# EAGLE design Control board V5 (EAGLE 8.2.1)
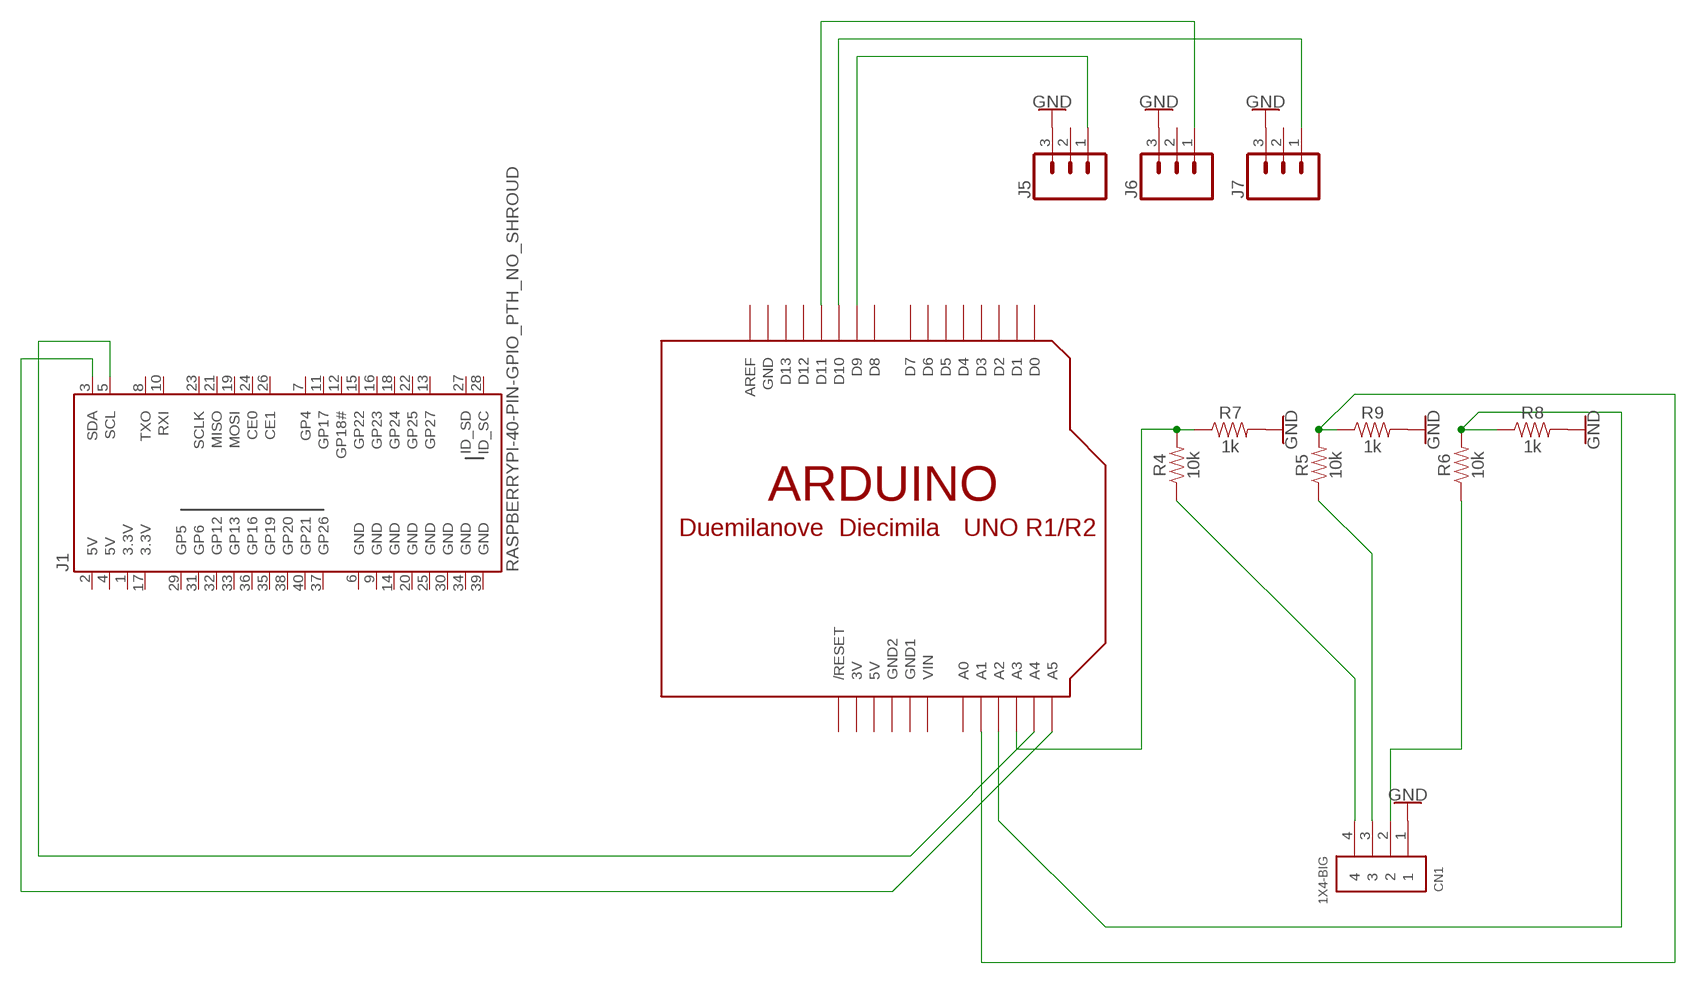
[diagram p0: schematic, sheet 1]

## Parts
CN1  1X4-BIG  [1X04-BIG]
J1  RASPBERRYPI-40-PIN-GPIO_PTH_NO_SHROUD  [2X20]
J5  CONN_03  [1X03]
J6  CONN_03  [1X03]
J7  CONN_03  [1X03]
R4  10k  10KOHM-HORIZ-1/4W-1%  [AXIAL-0.3]
R5  10k  10KOHM-HORIZ-1/4W-1%  [AXIAL-0.3]
R6  10k  10KOHM-HORIZ-1/4W-1%  [AXIAL-0.3]
R7  1k  1KOHM-HORIZ-1/4W-1%  [AXIAL-0.3]
R8  1k  1KOHM-HORIZ-1/4W-1%  [AXIAL-0.3]
R9  1k  1KOHM-HORIZ-1/4W-1%  [AXIAL-0.3]
U$1  ARDUINO-BPLACE  [ARDUINO-BPLACE]

## Nets
GND: CN1.1 J5.3 J6.3 J7.3 R7.P$2 R8.P$2 R9.P$2
N$1: J1.5(SCL) U$1.A4
N$2: J7.1 U$1.D10
N$3: J6.1 U$1.D11
N$4: R4.P$2 R7.P$1 U$1.A3
N$5: R6.P$2 R8.P$1 U$1.A2
N$6: CN1.3 R5.P$1
N$7: CN1.2 R6.P$1
N$8: J5.1 U$1.D9
N$9: J1.3(SDA) U$1.A5
N$10: CN1.4 R4.P$1
N$11: R5.P$2 R9.P$1 U$1.A1
Unconnected: J1.7(GP4) J1.8(TXO) J1.10(RXI) J1.11(GP17) J1.12(GP18#) J1.13(GP27) J1.15(GP22) J1.16(GP23) J1.18(GP24) J1.19(MOSI) J1.21(MISO) J1.22(GP25) J1.23(SCLK) J1.24(CE0) J1.26(CE1) J1.27(ID_SD) J1.28(ID_SC) J1.29(GP5) J1.31(GP6) J1.32(GP12) J1.33(GP13) J1.35(GP19) J1.36(GP16) J1.37(GP26) J1.38(GP20) J1.40(GP21) J5.2 J6.2 J7.2 U$1.A0 U$1.AREF U$1.D0 U$1.D1 U$1.D2 U$1.D3 U$1.D4 U$1.D5 U$1.D6 U$1.D7 U$1.D8 U$1.D12 U$1.D13 U$1.RESET(/RESET)

## Power pins joined to a net without a drawn wire
3.3V: J1.1(3.3V) J1.17(3.3V)
3V: U$1.3V
5V: J1.2(5V) J1.4(5V) U$1.5V
GND: J1.6(GND) J1.9(GND) J1.14(GND) J1.20(GND) J1.25(GND) J1.30(GND) J1.34(GND) J1.39(GND) U$1.GND
GND1: U$1.GND1
GND2: U$1.GND2
VIN: U$1.VIN

## Library data of the parts
CN1 = adafruit:1X4: 4-pin connector
J1 = SparkFun-Connectors:RASPBERRYPI-40-PIN-GPIO: Raspberry Pi GPIO Header 2x20 pin connector, as found on B, B+, A+ models. Both shrouded PTH and SMT versions available. SparkFun Products: GPIO Shrouded Header <https://www.sparkfun.com/products/13054>- PTH SparkFun Pi Wedge (Preassembled) <https://www.sparkfun.com/products/13717>
J5-J7 = SparkFun-Connectors:CONN_03: Multi connection point. Often used as Generic Header-pin footprint for 0.1 inch spaced/style header connections On any of the 0.1 inch spaced packages, you can populate with these: Break Away Headers - Straight <https://www.sparkfun.com/products/116> (PRT-00116) Break Away Male Headers - Right Angle <https://www.sparkfun.com/products/553> (PRT-00553) Female Headers <https://www.sparkfun.com/products/115> (PRT-00115) Break Away Headers - Machine Pin <https://www.sparkfun.com/products/117> (PRT-00117) Break Away Female Headers - Swiss Machine Pin <https://www.sparkfun.com/products/743> (PRT-00743) Stackable Header - 3 Pin (Female, 0.1") <https://www.sparkfun.com/products/13875> (PRT-13875) For SCREWTERMINALS and SPRING TERMINALS visit here: Screw Terimnals on SparkFun.com <https://www.sparkfun.com/search/results?term=Screw+Terminals> (5mm/3.5mm/2.54mm spacing) This device is also useful as a general connection point to wire up your design to another part of your project. Our various solder wires solder well into these plated through hole pads. Hook-Up Wire - Assortment (Stranded, 22 AWG) <https://www.sparkfun.com/products/11375> (PRT-11375) Hook-Up Wire - Assortment (Solid Core, 22 AWG) <https://www.sparkfun.com/products/11367> (PRT-11367) View the entire wire category on our website here <https://www.sparkfun.com/categories/141> Special notes: Molex polarized connector foot print use with SKU : PRT-08232 with associated crimp pins and housings.
R4-R6 = SparkFun-Resistors:10KOHM: 10kΩ resistor A resistor is a passive two-terminal electrical component that implements electrical resistance as a circuit element. Resistors act to reduce current flow, and, at the same time, act to lower voltage levels within circuits. - Wikipedia; PROD_ID: RES-12183
R7-R9 = SparkFun-Resistors:1KOHM: 1kΩ resistor A resistor is a passive two-terminal electrical component that implements electrical resistance as a circuit element. Resistors act to reduce current flow, and, at the same time, act to lower voltage levels within circuits. - Wikipedia; PROD_ID: RES-12182
U$1 = adafruit:ARDUINO: Arduino Diecimila/Duemilanove Make a shield with ease, this package has all the named pins as well as the two mounting drill holes and an outline of the USB and DC power connector. The outline is on the DIMENSION layer, so if your board house uses it they will cut the outline to match. http://www.ladyada.net/library/pcb/eaglelibrary.html

## Board
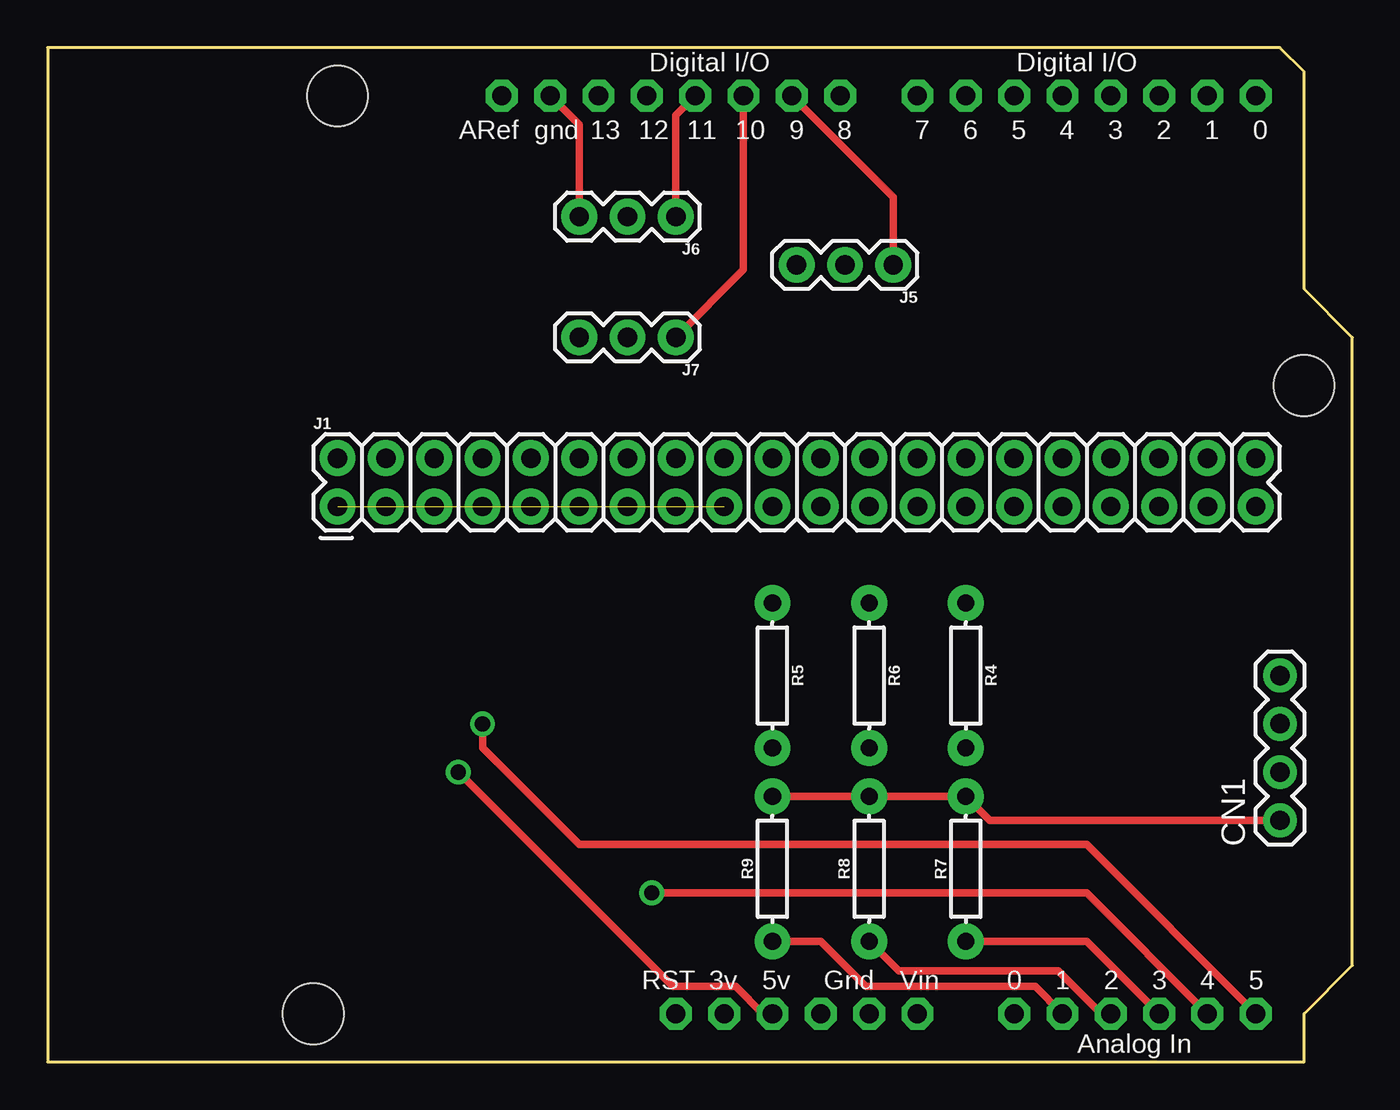
[diagram p1: board, top side]
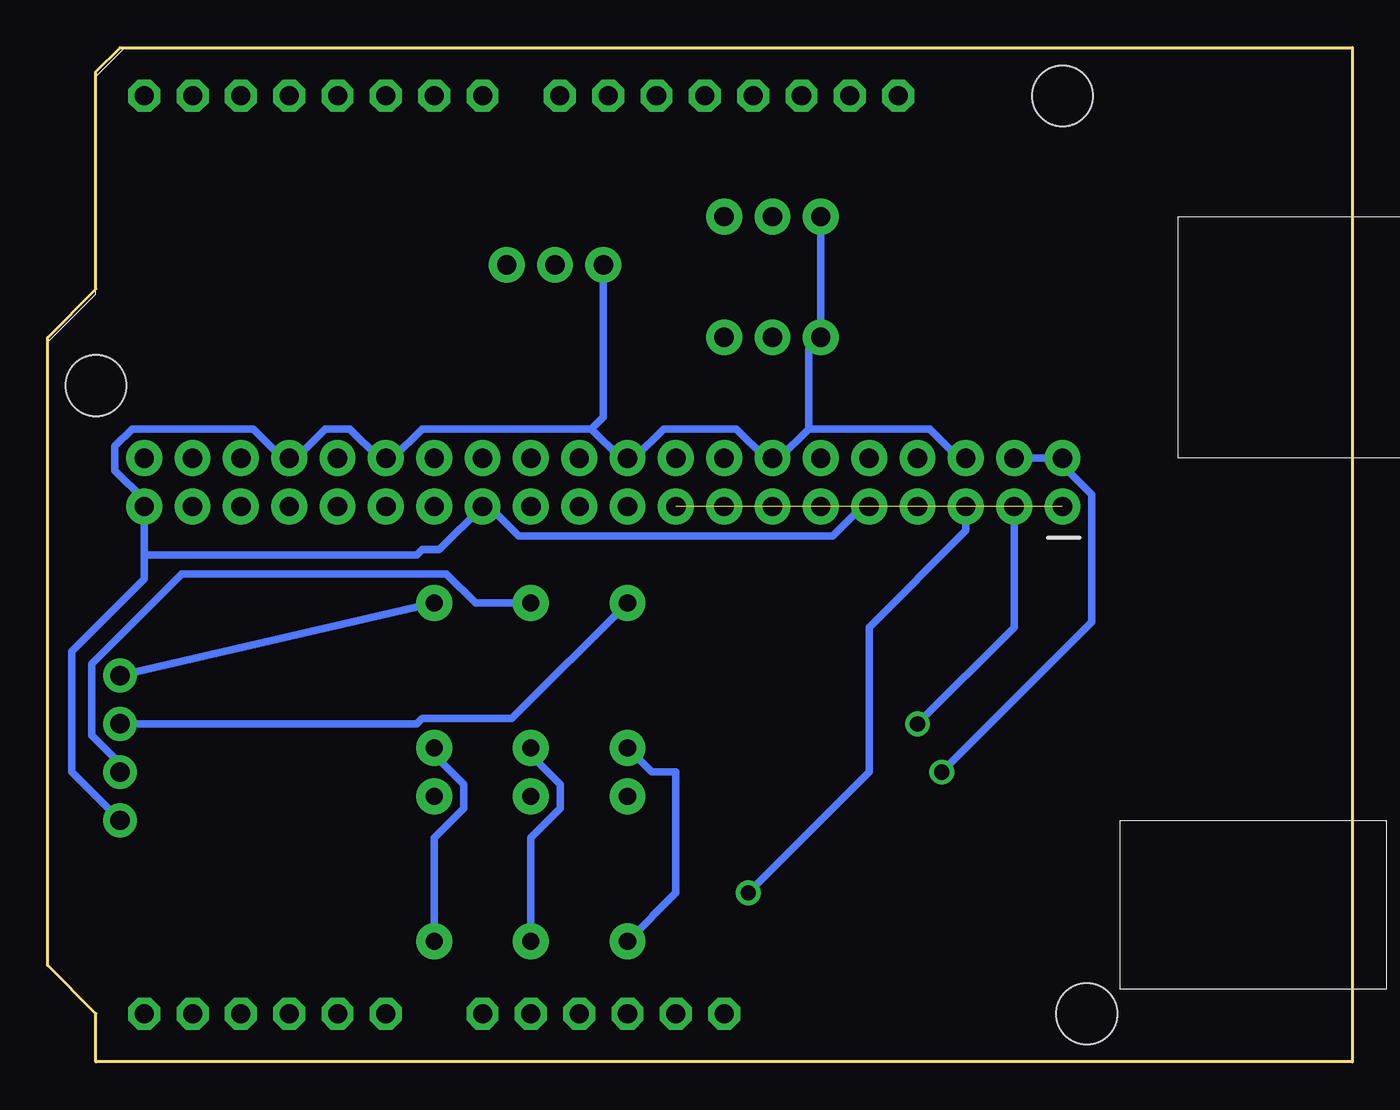
[diagram p2: board, bottom side, seen from below]

Size 68.58 x 53.34 mm. Coordinates in mm from the lower left corner, seen from the top.
Outline: 0,53.34 0,0 66.04,0 66.04,2.54 68.58,5.08 68.58,38.1 66.04,40.64 66.04,52.07 64.77,53.34 0,53.34
Copper layers (1*16): Top 0.035mm / dielectric 1.5mm / Bottom 0.035mm
Design rules "Othermill-DRC-1-64": minimum track width 8mil, minimum drill 0.8mm, track to track 0.39878125mm, track to pad 0.39878125mm, pad to pad 0.39878125mm, via to via 0.39878125mm, smd to smd 0mil, copper to edge 0mil, drill to drill 1mil, minimum pad ring 10mil, minimum via ring 10mil, stop-mask expansion 1mil, vias tented up to drill 30mil, thermal gap 10mil

### Footprints (pad centres in the part's own frame; a part is rotated, then mirrored left to right if it is on the bottom)
1X04-BIG = drill 1.016 pad 1.778: 1 0,0; 2 2.54,0; 3 5.08,0; 4 7.62,0
2X20 = drill 1.016 pad 1.88: 1 0,0; 2 0,2.54; 3 2.54,0; 4 2.54,2.54; 5 5.08,0; 6 5.08,2.54; 7 7.62,0; 8 7.62,2.54; 9 10.16,0; 10 10.16,2.54; 11 12.7,0; 12 12.7,2.54; 13 15.24,0; 14 15.24,2.54; 15 17.78,0; 16 17.78,2.54; 17 20.32,0; 18 20.32,2.54; 19 22.86,0; 20 22.86,2.54; 21 25.4,0; 22 25.4,2.54; 23 27.94,0; 24 27.94,2.54; 25 30.48,0; 26 30.48,2.54; 27 33.02,0; 28 33.02,2.54; 29 35.56,0; 30 35.56,2.54; 31 38.1,0; 32 38.1,2.54; 33 40.64,0; 34 40.64,2.54; 35 43.18,0; 36 43.18,2.54; 37 45.72,0; 38 45.72,2.54; 39 48.26,0; 40 48.26,2.54
1X03 = drill 1.016 pad 1.88: 1 0,0; 2 2.54,0; 3 5.08,0
AXIAL-0.3 = drill 0.9 pad 1.88: P$1 -3.81,0; P$2 3.81,0
ARDUINO-BPLACE = drill 1 pad 1.676 octagon: 3V 35.56,2.54; 5V 38.1,2.54; A0 50.8,2.54; A1 53.34,2.54; A2 55.88,2.54; A3 58.42,2.54; A4 60.96,2.54; A5 63.5,2.54; AREF 23.876,50.8; D0 63.5,50.8; D1 60.96,50.8; D2 58.42,50.8; D3 55.88,50.8; D4 53.34,50.8; D5 50.8,50.8; D6 48.26,50.8; D7 45.72,50.8; D8 41.656,50.8; D9 39.116,50.8; D10 36.576,50.8; D11 34.036,50.8; D12 31.496,50.8; D13 28.956,50.8; GND 26.416,50.8; GND1 43.18,2.54; GND2 40.64,2.54; RESET 33.02,2.54; VIN 45.72,2.54 | hole 3.2: 15.24,50.8; 66.04,35.56; 13.97,2.54

### Placement (x,y rotation side)
CN1  64.77,12.7 90 top
J1  15.24,29.21 0 top
J5  44.45,41.91 180 top
J6  33.02,44.45 180 top
J7  33.02,38.1 180 top
R4  48.26,20.32 270 top
R5  38.1,20.32 270 top
R6  43.18,20.32 270 top
R7  48.26,10.16 90 top
R8  43.18,10.16 90 top
R9  38.1,10.16 90 top
U$1  0,0 0 top

### Tracks (layer width: path | path; a pad name or v marks a point on that pad's centre or on a via)
3.3V  (1 unrouted)
5V  (via drill 0.8)
  Top 0.406: v21.59,15.24 32.85,3.98 36.16,3.98 37.6,2.54 U$1.5V
  Bottom 0.406: J1.4 J1.2 15.24,31.39 13.7,29.85 13.7,23.13 v21.59,15.24
GND
  Top 0.406: R9.P$2 R8.P$2 R7.P$2 49.53,12.7 CN1.1 | U$1.GND 27.94,49.28 J6.3
  Bottom 0.406: J1.6 20.68,31.75 22.22,33.29 28.58,33.29 | 28.58,33.29 30.12,31.75 J1.14 30.84,31.75 32.38,33.29 36.2,33.29 37.74,31.75 J1.20 38.46,31.75 40,33.29 | 28.58,33.29 28.58,37.46 J7.3 J6.3 | 63.5,26.67 J1.39 63.5,29.57 65.04,31.11 65.04,32.39 64.14,33.29 57.78,33.29 56.24,31.75 J1.34 55.52,31.75 53.98,33.29 52.7,33.29 51.16,31.75 J1.30 50.44,31.75 48.9,33.29 40,33.29 | 63.5,26.67 63.5,25.4 67.31,21.59 67.31,15.24 CN1.1 | 63.5,26.67 49.17,26.67 48.9,26.94 47.99,26.94 J1.25 45.36,29.21 43.82,27.67 27.3,27.67 25.76,29.21 J1.9 | J5.3 39.37,33.92 40,33.29
N$1  (via drill 0.8)
  Top 0.406: U$1.A4 54.61,8.89 v31.75,8.89
  Bottom 0.406: v31.75,8.89 25.4,15.24 25.4,22.86 20.32,27.94 J1.5
N$2
  Top 0.406: U$1.D10 36.58,41.66 J7.1
N$3
  Top 0.406: U$1.D11 33.02,49.78 J6.1
N$4
  Top 0.406: R7.P$1 54.61,6.35 U$1.A3
  Bottom 0.406: R7.P$1 48.26,11.79 46.72,13.33 46.72,14.61 48.26,16.15 R4.P$2
N$5
  Top 0.406: R8.P$1 44.75,4.78 53.13,4.78 55.38,2.54 U$1.A2
  Bottom 0.406: R8.P$1 43.18,11.79 41.64,13.33 41.64,14.61 43.18,16.15 R6.P$2
N$6
  Bottom 0.406: CN1.3 49.17,17.78 48.9,18.05 44.18,18.05 R5.P$1
N$7
  Bottom 0.406: CN1.2 64.77,15.67 66.26,17.16 66.26,20.94 61.53,25.67 47.62,25.67 46.08,24.13 R6.P$1
N$8
  Top 0.406: U$1.D9 44.45,45.47 J5.1
N$9  (via drill 0.8)
  Top 0.406: U$1.A5 54.61,11.43 27.94,11.43 22.86,16.51 v22.86,17.78
  Bottom 0.406: v22.86,17.78 17.78,22.86 J1.3
N$10
  Bottom 0.406: CN1.4 R4.P$1
N$11
  Top 0.406: R9.P$1 40.64,6.35 43.01,3.98 51.9,3.98 U$1.A1
  Bottom 0.406: R9.P$1 35.56,8.89 35.56,15.24 36.83,15.24 R5.P$2